# Altium schematic sheet DFN1X1_2.SchDoc
size A4; SheetNumber: 13; SheetTotal: 16
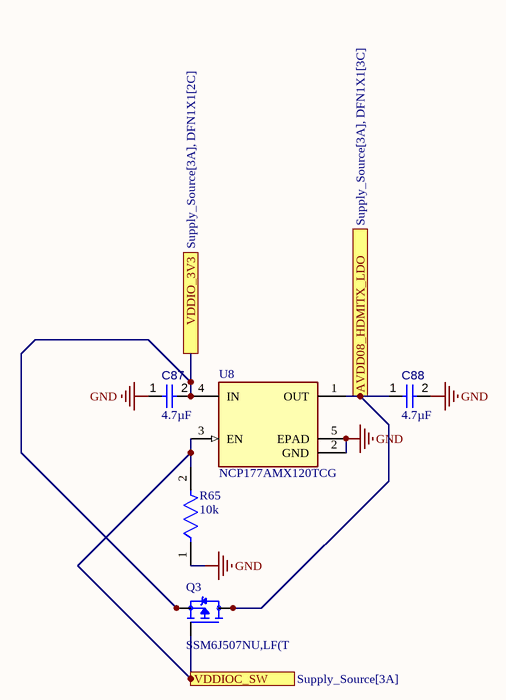
[diagram p0: DFN1X1_2.SchDoc]

## Parts
C87  value 4.7µF  [CAPC0603(1608)100_L]  (hidden comment: Capacitor 4.7µF +/-20% 10V 0603)
C88  value 4.7µF  [CAPC0603(1608)100_L]  (hidden comment: Capacitor 4.7µF +/-20% 10V 0603)
Q3  SSM6J507NU,LF(T  [TRANS_SSM6J507NU,LF(T]
R65  value 10k  [FP-RT0201-IPC_C]  (hidden comment: RT0201BRE0710KL)
U8  NCP177AMX120TCG  [FP-711AJ-MFG]

## Ports
AVDD08_HDMITX_LDO (see Supply_Source[3A], DFN1X1[3C]), VDDIO_3V3 (see Supply_Source[3A], DFN1X1[2C]), VDDIOC_SW (see Supply_Source[3A])

## Nets
GND: C87.1 C88.2 R65.1 U8.2(GND) U8.5(EPAD)
AVDD08_HDMITX_LDO: C88.1 Q3.1(D) Q3.2(D) Q3.5(D) Q3.6(D) Q3.7(D) U8.1(OUT) ; port AVDD08_HDMITX_LDO
VDDIO_3V3: C87.2 Q3.4(S) Q3.8(S) U8.4(IN) ; port VDDIO_3V3
VDDIOC_SW: Q3.3(G) R65.2 U8.3(EN) ; port VDDIOC_SW

## Library data of the parts
C87 C88 = CMP-001-00076-4: Chip Capacitor, 4.7µF +/-20%, 10V, 0603, Thickness 1 mm; Tolerance: 10%; Mounting Technology: SMT; Case/Package: 0603; Pins: 2; Min Operating Temperature: -55°C; Max Operating Temperature: 85°C; Voltage Rating: 10V
Q3 = CMP-029-000000-1: P-Channel 30V 10A (Ta) 1.25W (Ta) Surface Mount 6-UDFNB (2x2); Component Type: Standard; Value: *; Design Item ID: SSM6J507NU,LF(T; Source: SSM6J507NU,LF(T.SchLib; Package: None; Availability: Unavailable; MP: SSM6J507NU,LF(T; Pin Count: 8; Price: None
R65 = CMP-009-00210-1: Fixed Resistor, Thin Film, 0.05W, 10000ohm, 25V, 0.1% +/-Tol, 50ppm/Cel, Surface Mount, 0201; Max Operating Temperature: 125°C; Min Operating Temperature: -55°C; Case/Package: 0201; Mounting Technology: Surface Mount; Voltage Rating: 25V; Tolerance: 0.1%
U8 = CMP-07128-000002-1: IC REG LINEAR 1.2V 500MA 4XDFN; Manufacturer: ON Semiconductor; Dropout Voltage: 295mV; Max Supply Voltage: 5.5V; Nominal Supply Current: 60uA; Accuracy Percentage: 1.2%; Output Type: Fixed; Standoff Height: 0mm; Min Supply Voltage: 1.6V; Max Junction Temp: +150°C; Number Of Outputs: 1; Output Current: 500mA; ComponentLink2Description: Datasheet; Temperature: to +150°C; Category: IC; Device Class L3: Voltage Regulators - Linear; Manufacturer Part Number: NCP177AMX120TCG; RoHS: TRUE; Lead Free: Yes; Octopart: https://octopart.com/ncp177amx120tcg-on+semiconductor-67320276; Device Class L1: Integrated Circuits (ICs); Mouser Description: LDO Voltage Regulators FAST TRANSIENT RESPO; Digikey Description: IC REG LINEAR 1.2V 500MA 4XDFN; ComponentLink2URL: https://www.onsemi.com/pub/Collateral/NCP177-D.PDF; Output Voltage: 1.2V; Device Class L2: Power Management ICs; Package: 711AJ; Height: 0.43mm; Automotive: No; Footprint Url: https://www.onsemi.com/pub/Collateral/711AJ.PDF; Temperature Range High: +150°C